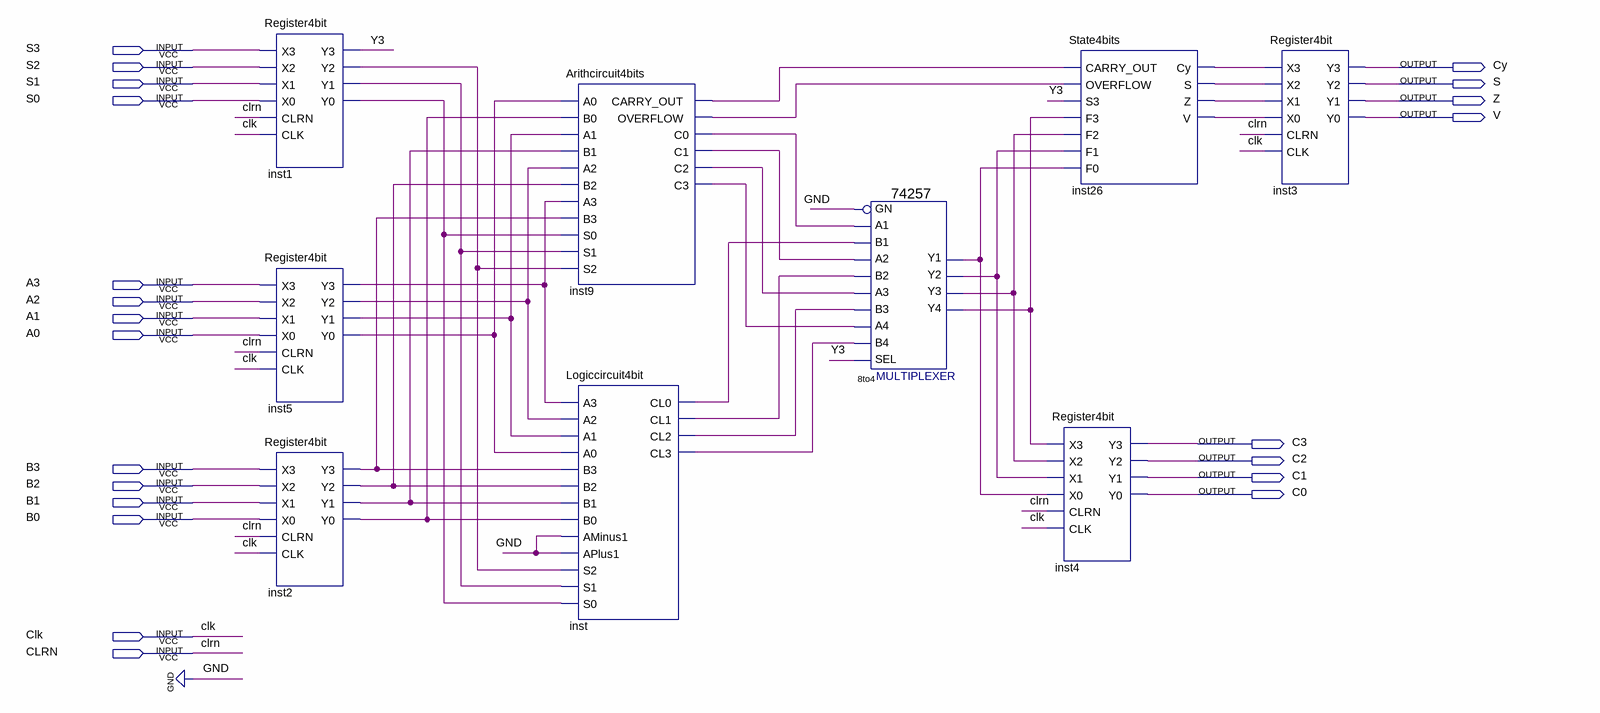
[diagram p0: schematic sheet]
// Quartus schematic Lab3top.bdf as structural Verilog: 9 symbols, 22 pins
module Lab3top (
  input  S3,
  input  S2,
  input  S1,
  input  S0,
  input  A3,
  input  A2,
  input  A1,
  input  A0,
  input  B3,
  input  B2,
  input  B1,
  input  B0,
  input  Clk,
  input  CLRN,
  output Cy,
  output S,
  output Z,
  output V,
  output C3,
  output C2,
  output C1,
  output C0
);

  wire inst1_y0, inst1_y1, inst1_y2, inst2_y0, inst2_y1, inst2_y2, inst2_y3, inst5_y0, inst5_y1, inst5_y2,
       inst5_y3, inst9_c0, inst9_c1, inst9_c2, inst9_c3, inst9_carry_out, inst9_overflow, inst26_cy,
       inst26_s, inst26_v, inst26_z, inst_cl0, inst_cl1, inst_cl2, inst_cl3, n8to4_y1, n8to4_y2, n8to4_y3,
       n8to4_y4, Y3;

  Register4bit inst1 (
    .X3(S3), .X2(S2), .X1(S1), .X0(S0), .CLRN(CLRN), .CLK(Clk), .Y3(Y3), .Y2(inst1_y2), .Y1(inst1_y1),
    .Y0(inst1_y0));
  Register4bit inst5 (
    .X3(A3), .X2(A2), .X1(A1), .X0(A0), .CLRN(CLRN), .CLK(Clk), .Y3(inst5_y3), .Y2(inst5_y2), .Y1(inst5_y1),
    .Y0(inst5_y0));
  Register4bit inst2 (
    .X3(B3), .X2(B2), .X1(B1), .X0(B0), .CLRN(CLRN), .CLK(Clk), .Y3(inst2_y3), .Y2(inst2_y2), .Y1(inst2_y1),
    .Y0(inst2_y0));
  Arithcircuit4bits inst9 (
    .A0(inst5_y0), .B0(inst2_y0), .A1(inst5_y1), .B1(inst2_y1), .A2(inst5_y2), .B2(inst2_y2), .A3(inst5_y3),
    .B3(inst2_y3), .S0(inst1_y0), .S1(inst1_y1), .S2(inst1_y2), .CARRY_OUT(inst9_carry_out),
    .OVERFLOW(inst9_overflow), .C0(inst9_c0), .C1(inst9_c1), .C2(inst9_c2), .C3(inst9_c3));
  Logiccircuit4bit inst (
    .A3(inst5_y3), .A2(inst5_y2), .A1(inst5_y1), .A0(inst5_y0), .B3(inst2_y3), .B2(inst2_y2), .B1(inst2_y1),
    .B0(inst2_y0), .AMinus1(1'b0), .APlus1(1'b0), .S2(inst1_y2), .S1(inst1_y1), .S0(inst1_y0),
    .CL0(inst_cl0), .CL1(inst_cl1), .CL2(inst_cl2), .CL3(inst_cl3));
  \74257  u_8to4 (
    .B1(inst_cl0), .A1(inst9_c0), .B3(inst_cl2), .A2(inst9_c1), .B2(inst_cl1), .A3(inst9_c2), .A4(inst9_c3),
    .B4(inst_cl3), .SEL(Y3), .GN(1'b0), .Y2(n8to4_y2), .Y3(n8to4_y3), .Y4(n8to4_y4), .Y1(n8to4_y1));
  State4bits inst26 (
    .CARRY_OUT(inst9_carry_out), .OVERFLOW(inst9_overflow), .S3(Y3), .F3(n8to4_y4), .F2(n8to4_y3),
    .F1(n8to4_y2), .F0(n8to4_y1), .Cy(inst26_cy), .S(inst26_s), .Z(inst26_z), .V(inst26_v));
  Register4bit inst4 (
    .X3(n8to4_y4), .X2(n8to4_y3), .X1(n8to4_y2), .X0(n8to4_y1), .CLRN(CLRN), .CLK(Clk), .Y3(C3), .Y2(C2),
    .Y1(C1), .Y0(C0));
  Register4bit inst3 (
    .X3(inst26_cy), .X2(inst26_s), .X1(inst26_z), .X0(inst26_v), .CLRN(CLRN), .CLK(Clk), .Y3(Cy), .Y2(S),
    .Y1(Z), .Y0(V));
endmodule
